# Altium project Motherboard_stm.PrjPcb
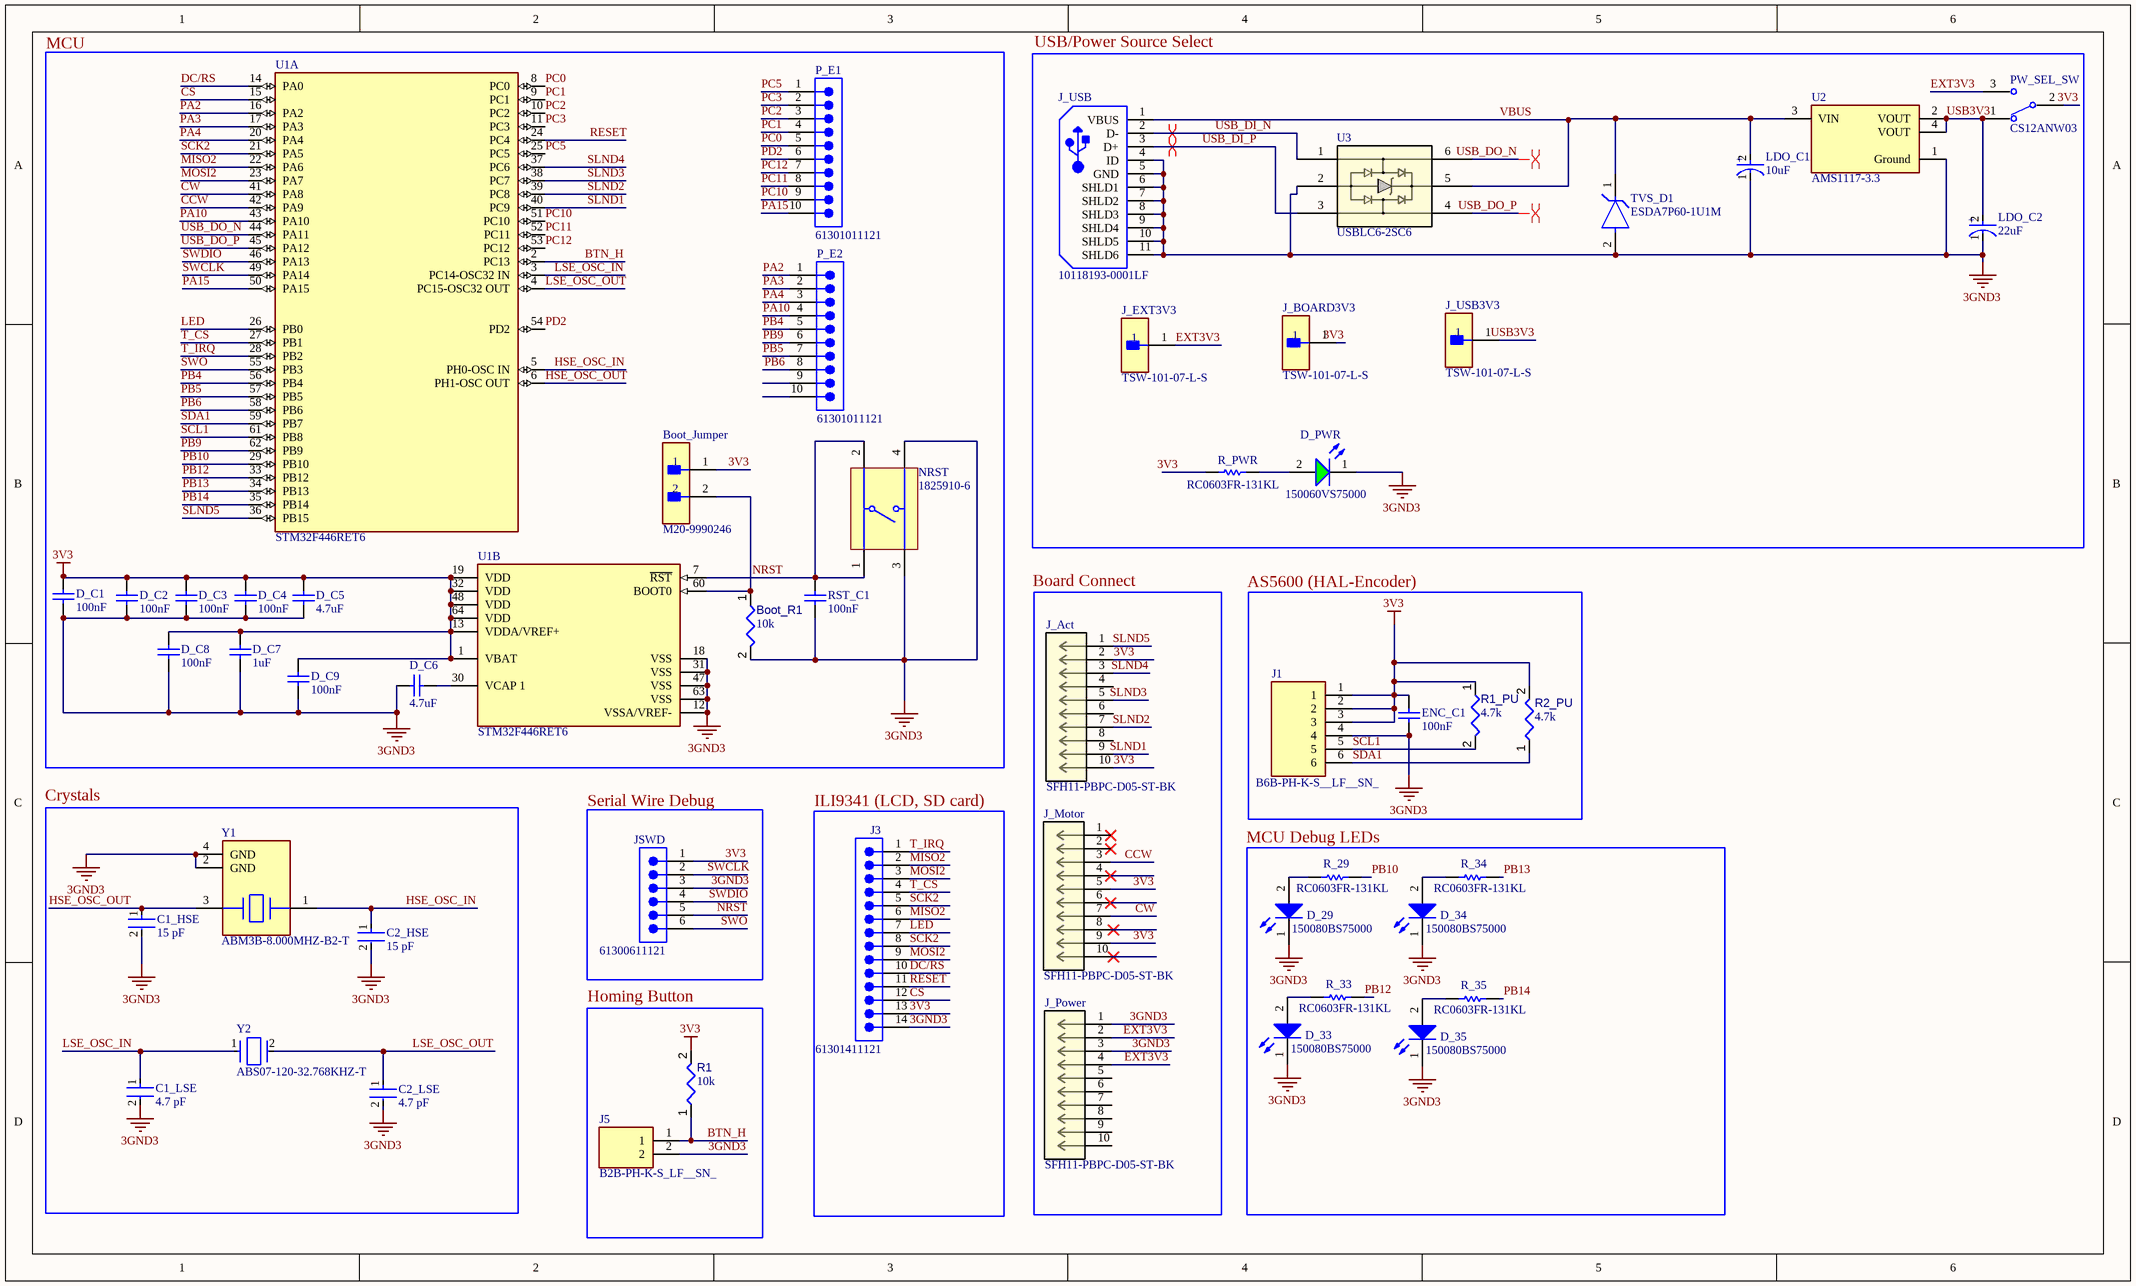
[diagram p0: Interconnect.SchDoc]
1 sheet, 53 parts. Net scope: global (net labels, ports and power ports of the same name join across sheets).
Board file: Motherboard_R2.PcbDoc

## Sheet Interconnect.SchDoc
size 400 x 240 mm

### Parts
Boot_Jumper  M20-9990246  [FP-M20-9990246-MFG]
Boot_R1  value 10k  [RESC1608X55X25ML10T15]  (hidden comment: Resistor 10k +/-1% 0603 100 mW)
C1_HSE  15 pF  [FP-GJM155-0_05-MFG]
C1_LSE  4.7 pF  [FP-GJM155-0_05-MFG]
C2_HSE  15 pF  [FP-GJM155-0_05-MFG]
C2_LSE  4.7 pF  [FP-GJM155-0_05-MFG]
D_29  150080BS75000  [WL-SMCW_0805_150080xx75000]
D_33  150080BS75000  [WL-SMCW_0805_150080xx75000]
D_34  150080BS75000  [WL-SMCW_0805_150080xx75000]
D_35  150080BS75000  [WL-SMCW_0805_150080xx75000]
D_C1  100nF  [CAPC1608X90X35NL15T15]
D_C2  100nF  [CAPC1608X90X35NL15T15]
D_C3  100nF  [CAPC1608X90X35NL15T15]
D_C4  100nF  [CAPC1608X90X35NL15T15]
D_C5  4.7uF  [CAPC1608X90X35NL15T15]
D_C6  4.7uF  [CAPC1608X90X35NL15T15]
D_C7  1uF  [CAPC1608X90X35NL15T15]
D_C8  100nF  [CAPC1608X90X35NL15T15]
D_C9  100nF  [CAPC1608X90X35NL15T15]
D_PWR  150060VS75000  [WL-SMCW_0603_150060xx75000]
ENC_C1  100nF  [CAPC1608X90X35NL15T15]
J1  B6B-PH-K-S__LF__SN_  [SHDR6W50P0X200_1X6_1390X450X600P]
J3  61301411121  [61301411121]
J5  B2B-PH-K-S_LF__SN_  [SHDR2W50P0X200_1X2_590X450X600P]
J_Act  SFH11-PBPC-D05-ST-BK  [CONN_SFH11-xxxC-D05-ST-XX_SUL]
J_BOARD3V3  TSW-101-07-L-S  [FP-TSW-101-07-L-S-MFG]
J_EXT3V3  TSW-101-07-L-S  [FP-TSW-101-07-L-S-MFG]
J_Motor  SFH11-PBPC-D05-ST-BK  [CONN_SFH11-xxxC-D05-ST-XX_SUL]
J_Power  SFH11-PBPC-D05-ST-BK  [CONN_SFH11-xxxC-D05-ST-XX_SUL]
J_USB  10118193-0001LF  [FCI-10118193-0001LF-5_V]
J_USB3V3  TSW-101-07-L-S  [FP-TSW-101-07-L-S-MFG]
JSWD  61300611121  [61300611121]
LDO_C1  10uF  [FP-TAJA-MFG]
LDO_C2  22uF  [FP-TAJA-MFG]
NRST  1825910-6  [TECO-1825910-6_V]
P_E1  61301011121  [61301011121]
P_E2  61301011121  [61301011121]
PW_SEL_SW  CS12ANW03  [FP-CS12ANW03-MFG]
R1  value 10k  [RESC1608X55X25ML10T15]  (hidden comment: Resistor 10k +/-1% 0603 100 mW)
R1_PU  value 4.7k  [RESC1608X55X25ML10T15]  (hidden comment: Resistor 10k +/-1% 0603 100 mW)
R2_PU  value 4.7k  [RESC1608X55X25ML10T15]  (hidden comment: Resistor 10k +/-1% 0603 100 mW)
R_29  RC0603FR-131KL  [RESC1608X55X25NL10T15]
R_33  RC0603FR-131KL  [RESC1608X55X25NL10T15]
R_34  RC0603FR-131KL  [RESC1608X55X25NL10T15]
R_35  RC0603FR-131KL  [RESC1608X55X25NL10T15]
R_PWR  RC0603FR-131KL  [RESC1608X55X25NL10T15]
RST_C1  100nF  [CAPC1608X90X35NL15T15]
TVS_D1  ESDA7P60-1U1M  [FP-1610-MFG]
U1  STM32F446RET6  [FP-LQFP64-5W-MFG]  (parts A,B of 2)
U2  AMS1117-3.3  [FP-AMS1117-IPC_C]
U3  USBLC6-2SC6  [SOT23-6L_STM]
Y1  ABM3B-8.000MHZ-B2-T  [FP-ABM3B-MFG]
Y2  ABS07-120-32.768KHZ-T  [FP-ABS07-120-MFG]

### Blocks framed on the sheet
MCU: Boot_Jumper Boot_R1 D_C1-D_C9 NRST P_E1 P_E2 RST_C1 U1
USB/Power Source Select: D_PWR J_BOARD3V3 J_EXT3V3 J_USB J_USB3V3 LDO_C1 LDO_C2 PW_SEL_SW R_PWR TVS_D1 U2 U3
Board Connect: J_Act J_Motor J_Power
AS5600 (HAL-Encoder): ENC_C1 J1 R1_PU R2_PU
Crystals: C1_HSE C1_LSE C2_HSE C2_LSE Y1 Y2
Serial Wire Debug: JSWD
ILI9341 (LCD, SD card): J3
MCU Debug LEDs: D_29 D_33-D_35 R_29 R_33-R_35
Homing Button: J5 R1

### Nets
3GND3: Boot_R1.2 C1_HSE.2 C1_LSE.2 C2_HSE.2 C2_LSE.2 D_29.1(K) D_33.1(K) D_34.1(K) D_35.1(K) D_C1.2 D_C2.2 D_C3.2 D_C4.1 D_C5.2 D_C6.2 D_C7.1 D_C8.1 D_C9.2 D_PWR.1(K) ENC_C1.1 J1.4 J3.14 J5.2 J_Power.1 J_Power.3 J_USB.4(ID) J_USB.5(GND) J_USB.6(SHLD1) J_USB.7(SHLD2) J_USB.8(SHLD3) J_USB.9(SHLD4) J_USB.10(SHLD5) J_USB.11(SHLD6) JSWD.3 LDO_C1.1(C) LDO_C2.1(C) NRST.3 NRST.4 RST_C1.2 TVS_D1.2(A) U1.12(VSSA/VREF-) U1.18(VSS) U1.31(VSS) U1.47(VSS) U1.63(VSS) U2.1(Ground) U3.2 Y1.2(GND) Y1.4(GND)
3V3: Boot_Jumper.1 D_C1.1 D_C2.1 D_C3.1 D_C4.2 D_C5.1 D_C7.2 D_C8.2 D_C9.1 ENC_C1.2 J1.1 J1.2 J1.3 J3.13 J_Act.2 J_Act.10 J_BOARD3V3.1 J_Motor.5 J_Motor.9 JSWD.1 PW_SEL_SW.2(2(COM)) R1.2 R1_PU.1 R2_PU.2 R_PWR.1 U1.1(VBAT) U1.13(VDDA/VREF+) U1.19(VDD) U1.32(VDD) U1.48(VDD) U1.64(VDD)
BTN_H: J5.1 R1.1 U1.2(PC13)
CCW: J_Motor.3 U1.42(PA9)
CS: J3.12 U1.15(PA1)
CW: J_Motor.7 U1.41(PA8)
DC/RS: J3.10 U1.14(PA0)
EXT3V3: J_EXT3V3.1 J_Power.2 J_Power.4 PW_SEL_SW.3
HSE_OSC_IN: C2_HSE.1 U1.5(PH0-OSC_IN) Y1.1
HSE_OSC_OUT: C1_HSE.1 U1.6(PH1-OSC_OUT) Y1.3
LED: J3.7 U1.26(PB0)
LSE_OSC_IN: C1_LSE.1 U1.3(PC14-OSC32_IN) Y2.1
LSE_OSC_OUT: C2_LSE.1 U1.4(PC15-OSC32_OUT) Y2.2
MISO2: J3.2 J3.6 U1.22(PA6)
MOSI2: J3.3 J3.9 U1.23(PA7)
NRST: JSWD.5 NRST.1 NRST.2 RST_C1.1 U1.7(~{RST})
PA2: P_E2.1 U1.16(PA2)
PA3: P_E2.2 U1.17(PA3)
PA4: P_E2.3 U1.20(PA4)
PA10: P_E2.4 U1.43(PA10)
PA15: P_E1.10 U1.50(PA15)
PB4: P_E2.5 U1.56(PB4)
PB5: P_E2.7 U1.57(PB5)
PB6: P_E2.8 U1.58(PB6)
PB9: P_E2.6 U1.62(PB9)
PB10: R_29.2 U1.29(PB10)
PB12: R_33.2 U1.33(PB12)
PB13: R_34.2 U1.34(PB13)
PB14: R_35.2 U1.35(PB14)
PC0: P_E1.5 U1.8(PC0)
PC1: P_E1.4 U1.9(PC1)
PC2: P_E1.3 U1.10(PC2)
PC3: P_E1.2 U1.11(PC3)
PC5: P_E1.1 U1.25(PC5)
PC10: P_E1.9 U1.51(PC10)
PC11: P_E1.8 U1.52(PC11)
PC12: P_E1.7 U1.53(PC12)
PD2: P_E1.6 U1.54(PD2)
RESET: J3.11 U1.24(PC4)
SCK2: J3.5 J3.8 U1.21(PA5)
SCL1: J1.5 R1_PU.2 U1.61(PB8)
SDA1: J1.6 R2_PU.1 U1.59(PB7)
SLND1: J_Act.9 U1.40(PC9)
SLND2: J_Act.7 U1.39(PC8)
SLND3: J_Act.5 U1.38(PC7)
SLND4: J_Act.3 U1.37(PC6)
SLND5: J_Act.1 U1.36(PB15)
SWCLK: JSWD.2 U1.49(PA14)
SWDIO: JSWD.4 U1.46(PA13)
SWO: JSWD.6 U1.55(PB3)
T_CS: J3.4 U1.27(PB1)
T_IRQ: J3.1 U1.28(PB2)
USB3V3: J_USB3V3.1 LDO_C2.2(A) PW_SEL_SW.1 U2.2(VOUT) U2.4(VOUT)
USB_DI_N: J_USB.2(D-) U3.1
USB_DI_P: J_USB.3(D+) U3.3
USB_DO_N: U1.44(PA11) U3.6
USB_DO_P: U1.45(PA12) U3.4
VBUS: J_USB.1(VBUS) LDO_C1.2(A) TVS_D1.1(C) U2.3(VIN) U3.5
NetBoot_Jumper_2: Boot_Jumper.2 Boot_R1.1 U1.60(BOOT0)
NetD_29_2: D_29.2(A) R_29.1
NetD_33_2: D_33.2(A) R_33.1
NetD_34_2: D_34.2(A) R_34.1
NetD_35_2: D_35.2(A) R_35.1
NetD_C6_1: D_C6.1 U1.30(VCAP_1)
NetD_PWR_2: D_PWR.2(A) R_PWR.2

Not connected (* = marked no-connect by the designer): J_Act 4 6 8; J_Motor 1* 2* 4* 6* 8* 10*; J_Power 5 6 7 8 9 10; P_E2 9 10

### Layout directives
differential pair: USB_DI_N, USB_DI_P, USB_DO_N, USB_DO_P

### Notes on the sheet
- (in symbol CMP-2000-07219-2) +

### Library data of the parts
Boot_Jumper = CMP-15831-000009-1: CONN HEADER VERT 2POS 2.54MM; Manufacturer: Harwin; Conn Gender: Male; Conn Orientation: Vertical; Number Of Contacts: 2; Current Rating: 3A; ComponentLink2URL: https://cdn.harwin.com/pdfs/M20-999.pdf; ComponentLink2Description: Datasheet; Package: M20-9990246; Temperature: -40°C to +105°C; Octopart: https://octopart.com/m20-9990246-harwin-2590635; Mouser Description: 2.54mm (0.1") Pitch SIL Vertical PC Tail Pin Header, 6.1mm mating pin height, tin, 2 contacts; Temperature Range High: +105°C; Device Class L1: Connectors; RoHS: TRUE; Automotive: No; Height: 8.99mm; Number Of Rows: 1; Contact Material: Tin,Nickel; Category: Conn; Pitch: 2.54mm; Lead Free: Yes; Digikey Description: CONN HEADER VERT 2POS 2.54MM; Manufacturer Part Number: M20-9990246; Temperature Range Low: -40°C; Device Class L3: unset; Device Class L2: Headers and Wire Housings
Boot_R1 R1 R1_PU R2_PU = CMP-009-00017-5: Chip Resistor, 10 KOhm, +/- 1%, 01 W, -55 to 155 degC, 0603 (1608 Metric); Voltage Rating: 50V; Power: 100mW; RoHS Compliant: True; Min Operating Temperature: -55°C; Pins: 2; Case/Package: 0603; Mounting Technology: SM; Max Operating Temperature: 155°C; Tolerance: 1%
C1_HSE C1_LSE C2_HSE C2_LSE = CMP-2008-03803-2: Multi-Layer Ceramic Capacitor 15pF C0G  ±2% 0402 Paper T/R; Voltage Rating: 50V; Termination: SMD/SMT; Min Operating Temperature: -55°C; Case Code (Imperial): 0402; Depth: 0.5mm; Case/Package: 0402; Capacitance: 15pF; Max Operating Temperature: 125°C; Lead Free: Lead Free; Width: 0.02inch; Mount: Surface Mount; Radiation Hardening: No; Case Code (Metric): 1005; Length: 1mm; Height: 0.5mm; Package Quantity: 10000; Packaging: Tape and Reel; Voltage Rating (DC): 50V; Tolerance: 2%; Dielectric: C0G; Thickness: 0.022inch
D_29 D_33-D_35 = CMP-1426-00008-7: Led, Blue, 470 Nm, 3.2 V, 30 Ma, 145 Mcd Rohs Compliant: Yes; Dominant Wavelength: 470nm; Max Junction Temperature (Tj): 95°C; Power Dissipation: 105mW; Peak Wavelength: 465nm; Max Reverse Voltage (DC): 5V; Forward Current: 100mA; Test Current: 20mA; Luminous Intensity: 145mcd; Lens Style: Clear, Rectangular; Viewing Angle: 140°; Forward Voltage: 3.2V; Color: Blue; Height: 700µm; Case Code (Imperial): 0805; Width: 1.25mm; REACH SVHC: Unknown; Case/Package: 0805; Lead Free: Lead Free; Mount: Surface Mount; Packaging: Tape and Reel; RoHS: Compliant; Reverse Voltage: 5V; Min Operating Temperature: -40°C; Case Code (Metric): 2012; Wavelength: 470nm; Max Operating Temperature: 85°C; Length: 2mm
D_C1-D_C9 ENC_C1 RST_C1 = CMP-2006-02299-1: Part Number: C0603C104K4RAC7013; Manufacturer: Kemet
D_PWR = CMP-1426-00006-7: WURTH ELEKTRONIK - 150060VS75000 - LED, Green, SMD, 0603, 30 mA, 2 V, 570 nm; Reverse Voltage: 5V; Power Dissipation: 72mW; Dominant Wavelength: 570nm; Peak Wavelength: 572nm; Forward Current: 100mA; Forward Voltage: 2V; Lens Style: Clear, Rectangular; Test Current: 20mA; Max Junction Temperature (Tj): 95°C; Viewing Angle: 140°; Luminous Intensity: 40mcd; Height: 700µm; Width: 800µm; Length: 1.6mm; Mount: Surface Mount; Min Operating Temperature: -40°C; Max Reverse Voltage (DC): 5V; Case Code (Imperial): 0603; Wavelength: 570nm; Color: Green; REACH SVHC: Unknown; RoHS: Compliant; Max Operating Temperature: 85°C; Packaging: Tape and Reel; Case/Package: 0603; Number of Pins: 2; Case Code (Metric): 1608
J1 = B6B-PH-K-S__LF__SN_: Connector; Manufacturer_Name: JST (JAPAN SOLDERLESS TERMINALS); Manufacturer_Part_Number: B6B-PH-K-S (LF)(SN); Datasheet Link: https://www.jst-mfg.com/product/pdf/eng/ePH.pdf; Height: 6mm; Arrow Part Number: B6B-PH-K-S (LF)(SN); Arrow Price/Stock: https://www.arrow.com/en/products/b6b-ph-k-s-lf-sn/jst-manufacturing
J3 = CMP-1502-01091-4: THT Vertical Pin Header WR-PHD, Pitch 2.54 mm, Single Row, 14 pins; Number of Positions: 14; Current Rating: 3A; Operating Supply Voltage: 250V; Contact Resistance: 20mΩ; Pitch: 2.54mm; Connector Type: Male Pin; Gender: Male; Orientation: Vertical; RoHS: Compliant; Packaging: Bulk; Lead Pitch: 2.54mm; Contact Material: Gold; Contact Plating: Gold; Min Operating Temperature: -40°C; Number of Rows: 1; Contact Mating Length: 5.9944mm; Color: Black; Voltage Rating: 250V; Termination: Solder; Max Operating Temperature: 105°C; Mount: Through Hole; Lead Free: Lead Free; Number of Pins: 14; Height: 8.89mm; Number of Contacts: 14
J5 = B2B-PH-K-S_LF__SN_: Connector; Manufacturer_Name: JST (JAPAN SOLDERLESS TERMINALS); Manufacturer_Part_Number: B2B-PH-K-S(LF)(SN); Datasheet Link: https://datasheet.lcsc.com/szlcsc/JST-Sales-America-B2B-PH-K-S-LF-SN_C131337.pdf; Height: 6mm; Mouser Part Number: 306-B2BPHKSLFSNPP; Mouser Price/Stock: https://www.mouser.co.uk/ProductDetail/JST-Commercial/B2B-PH-K-SLFSN?qs=cdbOS8ANM9AlozzPlOt72g%3D%3D; Arrow Part Number: B2B-PH-K-S(LF)(SN); Arrow Price/Stock: https://www.arrow.com/en/products/b2b-ph-k-s-lf-sn/jst-manufacturing.html?utm_currency=USD&region=europe
J_Act J_Motor J_Power = SFH11-PBPC-D05-ST-BK: Description; Manufacturer_Name: Sullins; Copyright: Copyright (C) 2025 Ultra Librarian. All rights reserved.; Manufacturer_Part_Number: SFH11-PBPC-D05-ST-BK; RefDes: RefDes; Type: Type
J_BOARD3V3 J_EXT3V3 J_USB3V3 = CMP-02766-001775-1: CONN HEADER VERT 1POS; Gender: Male; Number of Contacts: 1; Max Current Rating: 7.6A; Max Voltage Rating (AC): 550V; RoHS Compliant: Yes; Contact Finish - Mating: GOLD; Length: 2.54mm; Series: TSW; Insulation Material: PBT; Reach SVHC Compliant: Yes; Radiation Hardening: No; Contact Plating: Gold; Termination: Solder; Contact Type: Male Pin; Orientation: Straight; Number of Rows: 1; Depth: 2.54mm; Housing Material: Polyester; Lead Free: Lead Free; Fastening Type: Pull; Flammability Rating: UL94 V-0; Mount: Through Hole; Housing Color: Black; Contact Shape: Square; Min Operating Temperature: -55°C; Connector Type: Header; Contact Mating Length: 0.23inch; Width: 2.54mm; Packaging: Bulk; Contact Material: Bronze; Max Operating Temperature: 125°C; Number of Positions: 1; Color: Black; Insulation Color: Black
J_USB = CMP-2000-05119-1: Micro USB B Type Receptacle, -55 to 85 degC, 5-Pin SMD, RoHS, Tape and Reel; Manufacturer: FCI; Insulation Resistance: 1000MOhms; Gender: Female; Current Rating: 1.8A; Number of Contacts: 5Contact; Connector Type: MicroUSBTypeBreceptacle; Mounting Angle: Right; Datasheet Version: Rev. C, 05/2015; Packaging: Reel; Product Category: USBConnectors; Standard: USB2.0; Factory Pack Quantity: 1200; Operating Temperature Range: -55Cto+85C; Termination Style: SMD/SMT; Datasheet URL: http://datasheet.octopart.com/10118193-0001LF-FCI-datasheet-55953155.pdf; Contact Material: CopperAlloy; RoHS: Details; Contact Plating: Gold; Flammability Rating: UL94V-0; Manufacturer URL: http://www.fci.com/; Brand: FCI; Product: MicroUSBTypeBConnectors; Color: Black
JSWD = CMP-1502-01070-4: THT Vertical Pin Header WR-PHD, Pitch 2.54 mm, Single Row, 6 pins; Pitch: 2.54mm; Operating Supply Voltage: 250V; Connector Type: Male Pin; Gender: Male; Number of Positions: 6; Contact Resistance: 20mΩ; Current Rating: 3A; Termination: Through Hole; Color: Black; Number of Pins: 6; Lead Pitch: 2.54mm; Height: 8.89mm; RoHS: Compliant; Lead Free: Lead Free; Contact Mating Length: 5.9944mm; Contact Plating: Gold; Contact Gender: Male; Packaging: Bulk; Orientation: Vertical; Mount: Through Hole; Voltage Rating: 250V; Number of Rows: 1; Max Operating Temperature: 105°C; Min Operating Temperature: -40°C; Housing Material: PBT; Contact Material: Gold; Number of Contacts: 6
LDO_C1 LDO_C2 = CMP-2000-07219-2: 10uF 10V  ±20% 3Ω 1206  SMD Tantalum Capacitor; Polarity: Polar; ESR (Equivalent Series Resistance): 3R; Dissipation Factor: 6%; Leakage Current: 1uA; Construction: Flat; Packaging: Tape and Reel; Voltage Rating: 10V; Lead Free: Lead Free; Radiation Hardening: No; REACH SVHC: No SVHC; Termination: SMD/SMT; Case/Package: 1206; RoHS Compliant: Yes; Min Operating Temperature: -55°C; Depth: 1.6mm; Voltage Rating (DC): 10V; Series: TAJ; Capacitance: 10uF; Height: 1.6mm; Height - Seated (Max): 0.071inch; Tolerance: 20%; Package Quantity: 1; Voltage: 10V; Features: General Purpose; Max Operating Temperature: 125°C; Lead Pitch: 1.1mm; Dielectric Material: Tantalum; Width: 0.063inch; Mount: Surface Mount; Case Code (Metric): 3216; Case Code (Imperial): 1206; Length: 3.2mm; Number of Pins: 2
NRST = CMP-1684-00021-1: Tact Switch, SPST-NO, 0.05 A, -35 to 85 degC, 4-Pin THD, RoHS, Bulk; Manufacturer: TE Connectivity; Maximum Contact Resistance: 100mOhm; Mechanical Life: 100000Cycles; Bushing Type: Unthreaded; Switch Configuration: OFF(ON); Maximum DC Voltage Rating: 24V; Contact Rating @ Voltage: 0.05A@24VDC; Actuator Color: Black; Body Orientation: Straight; Function: MomentaryContact; Illumination: N/R; Actuator Style: RoundButton; Actuator Material: PolybutyleneTerephthalate; Dielectric Strength: 500VAC; Pole Throw Configuration: SPST; Actuator Length: 1.4mm; Product Weight: N/A; Contact Material: CopperAlloy; Housing Material: N/A; Terminal Type: PCPins; Minimum Insulation Resistance: 100MOhm; Package Description: 4-Pin Through Hole Device, Body 5.99 x 5.99 mm, Pitch 6.5 mm; Part No: 1825910-6; Package Reference: THD; Base Material: N/A; Manufacturer URL: http://www.te.com; Contact Plating: Silver; RoHS: Yes; Datasheet Version: Rev. C9; Electrical Life: 100000Cycles; Maximum AC Voltage Rating: N/A; Thread Size: N/R; Operating Temperature: -35to85C; Mounting: ThroughHole; Dimension: 5.99x5mm; Datasheet URL: http://www.te.com/commerce/DocumentDelivery/DDEController?Action=showdoc&DocId=Customer+Drawing%7F1825910%7FC9%7Fpdf%7FEnglish%7FENG_CD_1825910_C9.pdf%7F1825910-6; Family: 1825910; Seal Location: N/A; Seal Description: N/A; Packaging: N/A
P_E1 P_E2 = CMP-1502-01082-6: THT Vertical Pin Header WR-PHD, Pitch 2.54 mm, Single Row, 10 pins; Gender: Male; Voltage Rating: 250V; Connector Type: Male Pin; Current Rating: 3A; Number of Contacts: 10; Pitch: 2.54mm; Contact Resistance: 20mΩ; Insulation Resistance: 1GΩ; RoHS: Compliant; Length: 2.54mm; Max Operating Temperature: 105°C; Flammability Rating: UL94 V-0; Width: 25.4mm; Number of Positions: 10; Number of Rows: 1; Lead Pitch: 2.54mm; Number of Pins: 10; Termination: Solder; Operating Supply Voltage: 250V; Color: Black; Housing Material: PBT; Orientation: Vertical; Packaging: Bulk; Mount: Through Hole; Contact Mating Length: 5.9944mm; Contact Material: Gold; Height: 8.74mm; Min Operating Temperature: -40°C; Contact Plating: Gold; Contact Gender: Male
PW_SEL_SW = CMP-31746-000002-1: SWITCH SLIDE SPDT 3A 125V; Max Voltage Rating (AC): 250V; Mechanical Life: 50000Cycles; Switch Travel: 2.2mm; Electrical Life: 20000Cycles; Actuator Length: 5.1mm; Illumination Type: Non-Illuminated; Contact Style: Non-Shorting; Actuator Type: Standard; Actuator Material: Nylon; Switch Function: On-On; Max Operating Temperature: 85°C; Series: CS; Contact Current Rating: 3A; Min Operating Temperature: -30°C; Current Rating: 3A; Mount: Through Hole; Depth: 7.5mm; RoHS Compliant: Yes; Throw Configuration: SPDT; Lead Free: Lead Free; Orientation: Vertical; Contact Plating: Silver; Reach SVHC Compliant: Yes; Termination: PC Pin; Max Current Rating: 3A; Packaging: Tray; Length: 14mm; Package Quantity: 1; Primary Type: SWITCH; Flammability Rating: UL94 V-0; Contact Material: Copper; Voltage Rating (AC): 125V
R_29 R_33-R_35 R_PWR = CMP-2000-04205-1: Manufacturer: Yageo; Part Number: RC0603FR-131KL
TVS_D1 = CMP-12225-000013-1: TVS DIODE 5V 11.6V 1610; Manufacturer: STMicroelectronics; Number Of Channels: 1; Standoff Height: 0mm; Breakdown Voltage: 6.4V; Direction: Unidirectional; Clamping Voltage: 10.2V; Peak Pulse Power: 700W; Peak Pulse Current: 60A; Max Junction Temp: +150°C; ComponentLink2Description: Datasheet; Temperature Range Low: -55°C; Package: 1610; Lead Free: Yes; Temperature Range High: +150°C; Temperature: -55°C to +150°C; Device Class L2: TVS Diodes; Category: Diode; Device Class L1: Circuit Protection; Manufacturer Part Number: ESDA7P60-1U1M; Digikey Description: TVS DIODE 5V 11.6V 1610; ComponentLink2URL: http://www.st.com/content/ccc/resource/technical/document/datasheet/44/e9/26/44/42/ee/4f/e5/DM00139972.pdf/files/DM00139972.pdf/jcr:content/translations/en.DM00139972.pdf; Reverse Standoff Voltage: 5V; RoHS: TRUE; Octopart: https://octopart.com/esda7p60-1u1m-stmicroelectronics-52112702; Height: 0.65mm; Device Class L3: unset; Automotive: No
U1 = CMP-12105-000007-1: IC MCU 32BIT 512KB FLASH 64LQFP; Manufacturer: ST; Number Of Spi Channels: 4; Ram Size: 128KBytes; Standoff Height: 0.05mm; Number Of Uart Channels: 6; Number Of Pwm Channels: 32; Max Junction Temp: +105°C; Number Of I/Os: 50; Number Of Usb Channels: 2; Frequency: 180MHz; Number Of A/D Converters: 3; Max Supply Voltage: 3.6V; Number Of Adc Channels: 16; Interface: I2C,SPI,UART,USART,CAN,USB,LIN,IrDA,I2S,Other; Memory Size: 512KBytes; Number Of Timers/Counters: 14; Min Supply Voltage: 1.7V; Core Architecture: ARM Cortex-M4; Data Bus Width: 32bits; Number Of Cores: 1; Ambient Temperature Range Low: -40°C; ComponentLink2URL: https://www.st.com/en/microcontrollers-microprocessors/stm32f446re.html; Category: IC; Height: 1.6mm; Ipc Land Pattern Name: QFP50P1200X1200X160-64; Manufacturer Part Number: STM32F446RET6; Octopart: https://octopart.com/stm32f446ret6-stmicroelectronics-52642920; Temperature Range High: +105°C; Lead Free: Yes; Mouser Description: ARM Microcontrollers - MCU High-performance and DSP with FP, ARM Cortex-M4 MCU with 512 Kbytes Flash, 180 MHz CPU, Art Accelerator, SDRAM; Digikey Description: IC MCU 32BIT 512KB FLASH 64LQFP; Ambient Temperature Range High: +85°C; Number Of I2C Channels: 4; Memory Type: FLASH; RoHS: TRUE; Automotive: No; Device Class L1: Integrated Circuits (ICs); Temperature: -40°C to +105°C; Device Class L2: Embedded Processors and Controllers; Device Class L3: Microcontrollers; Temperature Range Low: -40°C; Package: LQFP64-5W; ComponentLink2Description: Datasheet
U2 = CMP-209535-000001-1: LDO Voltage Regulators 1A, 3.3V; Manufacturer: Advanced Monolithic Systems; Dropout Voltage: 1.1V; Output Type: Fixed; Nominal Supply Current: 5mA; Max Power Dissipation: 1.2W; Max Supply Voltage: 15V; Number Of Outputs: 1; Standoff Height: 0.64mm; Max Junction Temp: +125°C; Height: 1.8mm; Package: AMS1117; Device Class L2: Power Management ICs; ComponentLink2Description: Datasheet; ComponentLink2URL: http://www.advanced-monolithic.com/pdf/ds1117.pdf; Category: IC; RoHS: TRUE; Automotive: No; Device Class L1: Integrated Circuits (ICs); Output Current: 1A; Device Class L3: Voltage Regulators - Linear; Temperature: -40°C to +125°C; Output Voltage: 3.3V; Manufacturer Part Number: AMS1117-3.3; Temperature Range Low: -40°C; Octopart: https://octopart.com/ams1117-3.3-advanced+monolithic+systems-25899300; Lead Free: Yes; Ipc Land Pattern Name: SOT229P700X180-4; Temperature Range High: +125°C
U3 = USBLC6-2SC6: ESD Protection for USB 2.0 High Speed; Manufacturer_Name: STMicroelectronics; Copyright: Copyright (C) 2025 Ultra Librarian. All rights reserved.; Manufacturer_Part_Number: USBLC6-2SC6; RefDes: RefDes; Type: Type
Y1 = CMP-1688-00002-2: Crystal 8MHz ±20ppm 18pF SMD-4 5mm x 3.2mm; ESR (Equivalent Series Resistance): 200R; Frequency Stability: 50ppm; Operating Frequency: 8 MHz; Mount: Surface Mount; Number of Pins: 4; Packaging: Tape and Reel; Width: 0.126inch; Case/Package: CSMD; Lead Free: Lead Free; Depth: 3.2mm; Load Capacitance: 18pF; Min Operating Temperature: -20°C; Series: ABM3B; Package Quantity: 1000; Resistor Type: Ceramic; Height: 0.043inch; Max Operating Temperature: 70°C; Frequency Tolerance: 20ppm; Series Resistance: 200R; Tolerance: 20ppm; Termination: SMD/SMT; Length: 5mm; Frequency: 8MHz
Y2 = CMP-2000-07587-2: CRYSTAL 32.7680KHZ 6PF SMD; Frequency Tolerance: 20ppm; Series Resistance: 60kR; ESR (Equivalent Series Resistance): 55kR; Depth: 1.5mm; Width: 0.061inch; Number of Pins: 2; Max Operating Temperature: 85°C; Length: 3.2mm; Case/Package: SMD/SMT; Series: ABS07; Lead Free: Lead Free; Min Operating Temperature: -40°C; Load Capacitance: 6pF; Packaging: Tape and Reel; Height: 0.035inch; Radiation Hardening: No; Tolerance: 20ppm; Operating Frequency: 32.768 kHz; Termination: SMD/SMT; REACH SVHC: No SVHC; RoHS Compliant: Yes; Frequency: 32.768kHz; Package Quantity: 3000; Mount: Surface Mount